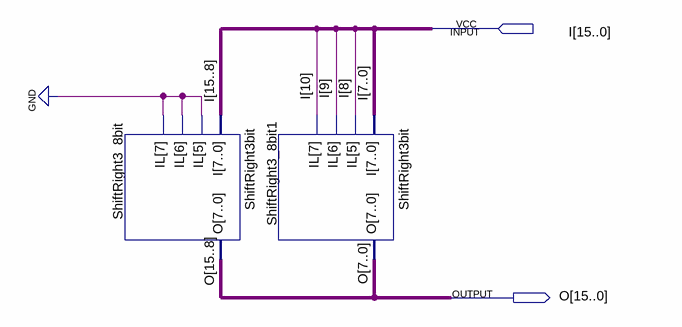
[diagram p0: schematic sheet]
// Quartus schematic ShiftRight3_16it.bdf as structural Verilog: 2 symbols, 2 pins
module ShiftRight3_16it (
  input  [15:0] I,
  output [15:0] O
);

  ShiftRight3bit ShiftRight3_8bit (.I(I[15:8]), .IL(3'b000), .O(O[15:8]));
  ShiftRight3bit ShiftRight3_8bit1 (.I(I[7:0]), .IL(I[10:8]), .O(O[7:0]));
endmodule
